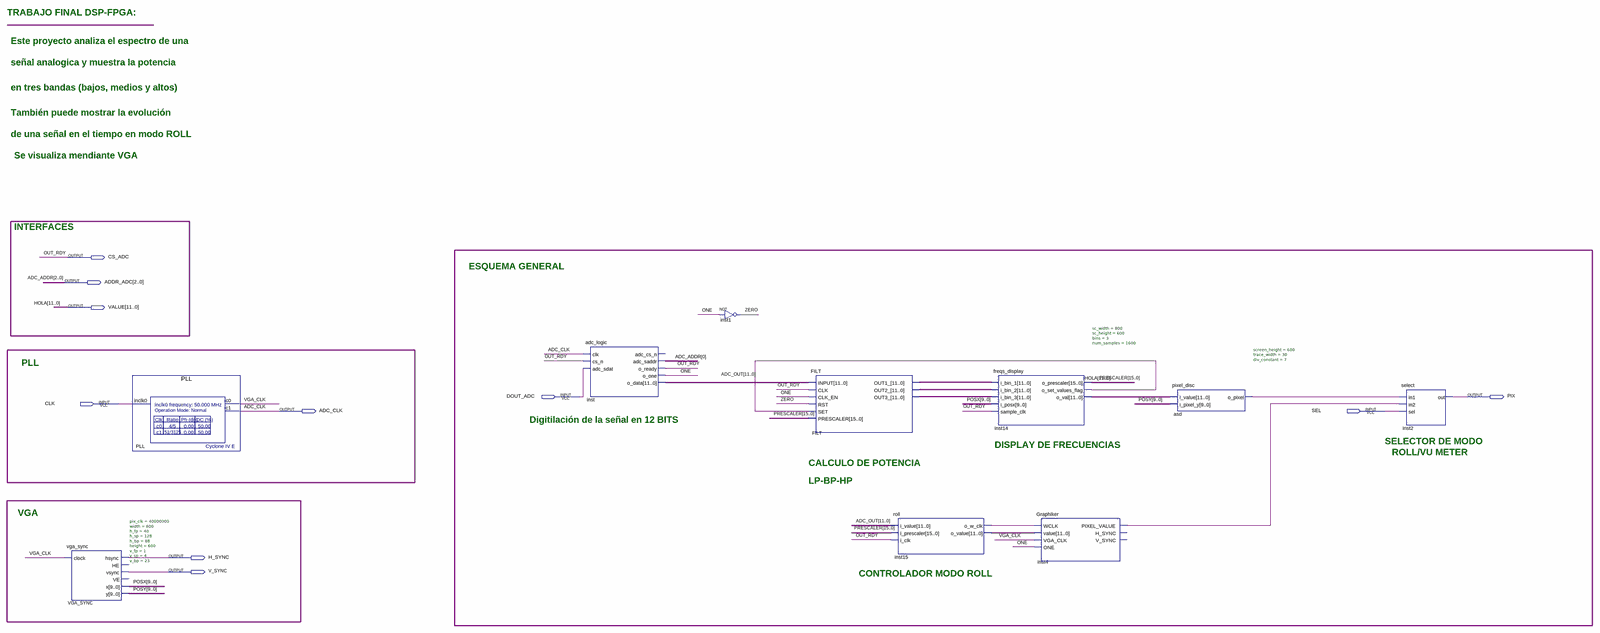
[diagram p0: schematic sheet, whole]
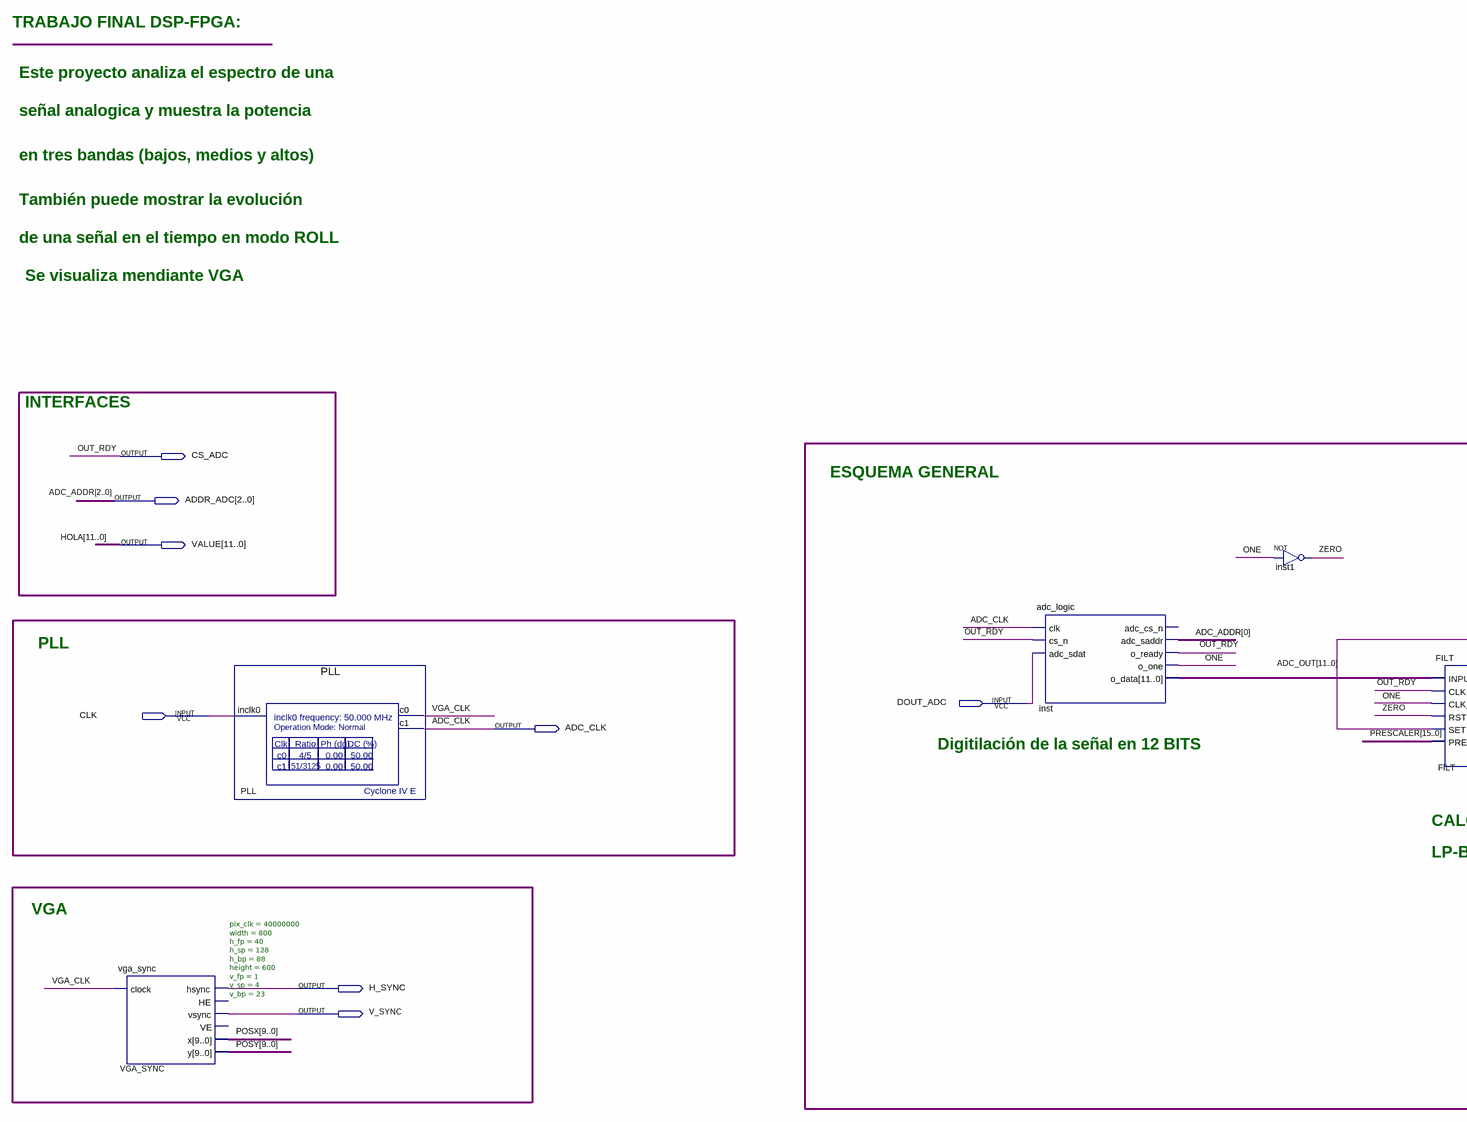
[diagram p1: schematic sheet, left part]
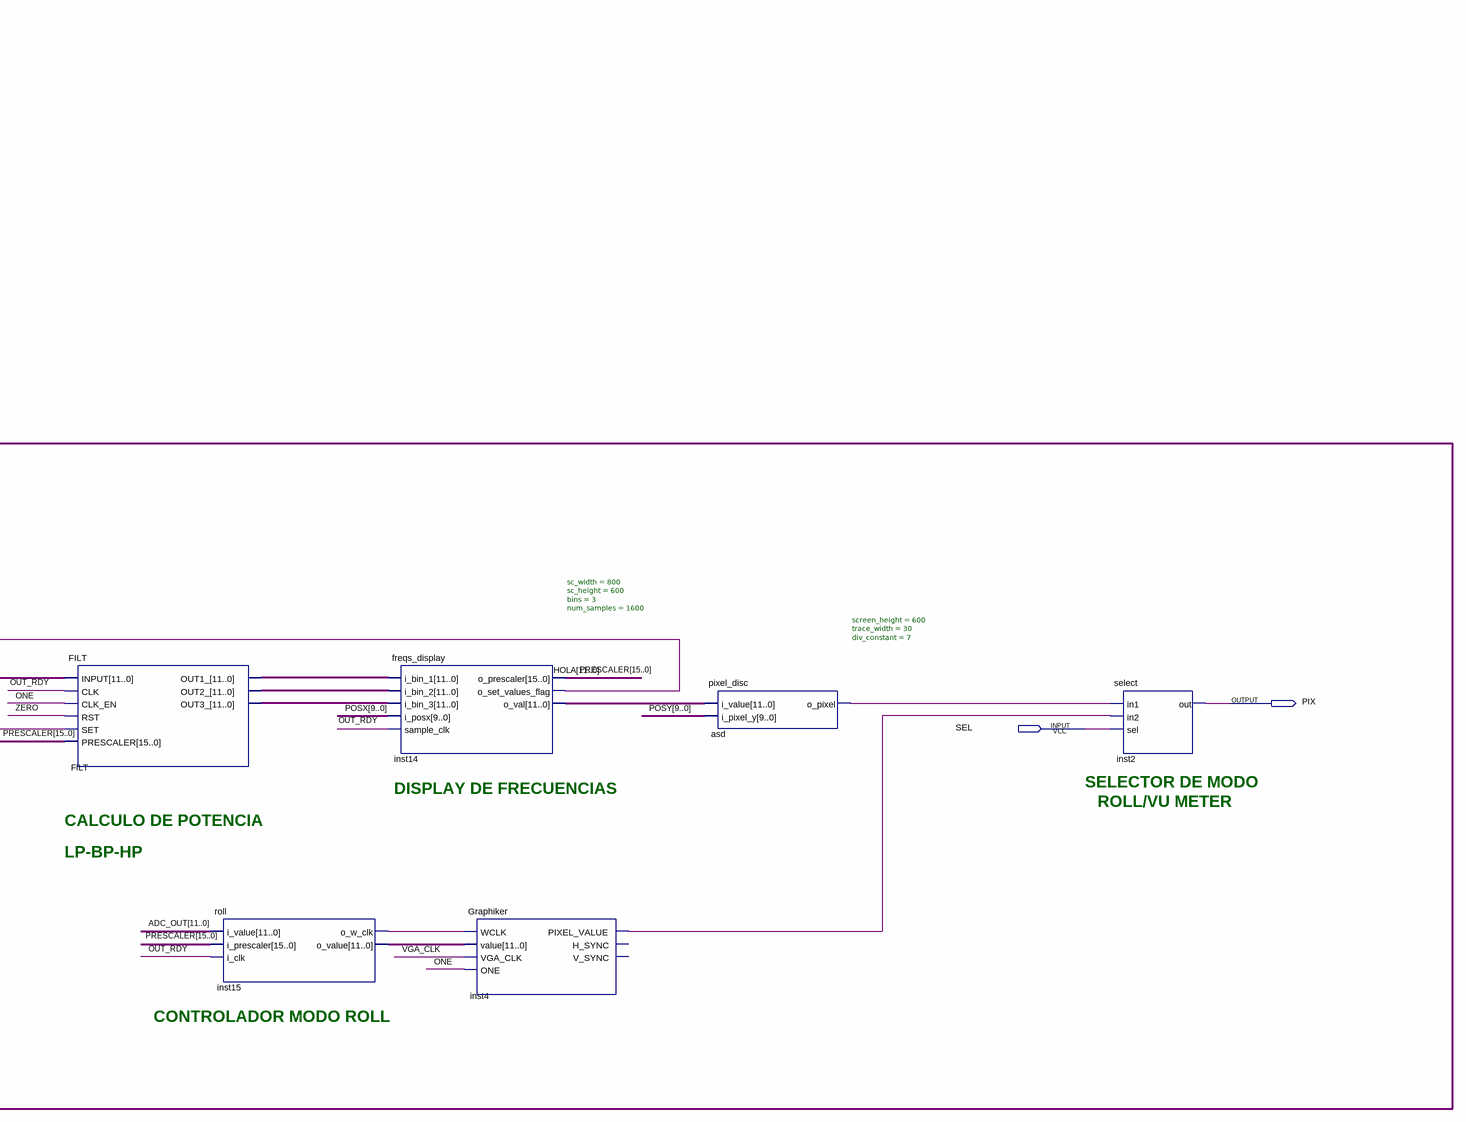
[diagram p2: schematic sheet, right part]
// Quartus schematic Integracion.bdf as structural Verilog: 10 symbols, 10 pins
module Integracion (
  input  DOUT_ADC,
  input  CLK,
  input  SEL,
  output CS_ADC,
  output [2:0] ADDR_ADC,
  output [11:0] VALUE,
  output PIX,
  output ADC_CLK,
  output H_SYNC,
  output V_SYNC
);

  wire asd_o_pixel, inst4_pixel_value, inst14_o_set_values_flag, inst15_o_w_clk, ONE, VGA_CLK, ZERO;
  wire [9:0] POSX, POSY;
  wire [11:0] ADC_OUT, FILT_out2_, FILT_out3_, inst14_o_val, inst15_o_value;
  wire [15:0] PRESCALER;

  vga_sync #(.pix_clk(40000000), .width(800), .h_fp(40), .h_sp(128), .h_bp(88), .height(600), .v_fp(1), .v_sp(4), .v_bp(23)) VGA_SYNC (
    .clock(VGA_CLK), .hsync(H_SYNC), .vsync(V_SYNC), .x(POSX), .y(POSY));  // open: HE, VE
  PLL PLL (.inclk0(CLK), .c0(VGA_CLK), .c1(ADC_CLK));
  adc_logic inst (
    .clk(ADC_CLK), .cs_n(CS_ADC), .adc_sdat(DOUT_ADC), .adc_saddr(ADDR_ADC[0]), .o_ready(CS_ADC),
    .o_one(ONE), .o_data(ADC_OUT));  // open: adc_cs_n
  not inst1 (ZERO, ONE);
  FILT FILT (
    .INPUT(ADC_OUT), .CLK(CS_ADC), .CLK_EN(ONE), .RST(ZERO), .SET(inst14_o_set_values_flag),
    .PRESCALER(PRESCALER), .OUT1_(VALUE), .OUT2_(FILT_out2_), .OUT3_(FILT_out3_));
  roll inst15 (
    .i_value(ADC_OUT), .i_prescaler(PRESCALER), .i_clk(CS_ADC), .o_w_clk(inst15_o_w_clk),
    .o_value(inst15_o_value));
  freqs_display #(.sc_width(800), .sc_height(600), .\bins (3), .num_samples(1600)) inst14 (
    .i_bin_1(VALUE), .i_bin_2(FILT_out2_), .i_bin_3(FILT_out3_), .i_posx(POSX), .sample_clk(CS_ADC),
    .o_prescaler(PRESCALER), .o_set_values_flag(inst14_o_set_values_flag), .o_val(inst14_o_val));
  Graphiker inst4 (
    .WCLK(inst15_o_w_clk), .value(inst15_o_value), .VGA_CLK(VGA_CLK), .ONE(ONE),
    .PIXEL_VALUE(inst4_pixel_value));  // open: H_SYNC, V_SYNC
  pixel_disc #(.screen_height(600), .trace_width(30), .div_constant(7)) asd (
    .i_value(inst14_o_val), .i_pixel_y(POSY), .o_pixel(asd_o_pixel));
  select inst2 (.in1(asd_o_pixel), .in2(inst4_pixel_value), .sel(SEL), .out(PIX));

  // Other names for the same wires on the sheet: ADC_ADDR[2:0] = ADDR_ADC; HOLA[11:0] = VALUE; OUT_RDY = CS_ADC

  // Notes on the sheet:
  //   TRABAJO FINAL DSP-FPGA:
  //   Este proyecto analiza el espectro de una
  //   señal analogica y muestra la potencia
  //   en tres bandas (bajos, medios y altos)
  //   También puede mostrar la evolución
  //   de una señal en el tiempo en modo ROLL
  //   Se visualiza mendiante VGA
  //   INTERFACES
  //   ESQUEMA GENERAL
  //   PLL
  //   Digitilación de la señal en 12 BITS
  //   SELECTOR DE MODO
  //   DISPLAY DE FRECUENCIAS
  //   ROLL/VU METER
  //   CALCULO DE POTENCIA
  //   LP-BP-HP
  //   VGA
  //   CONTROLADOR MODO ROLL
endmodule
